# Altium project Tube03.PrjPCB
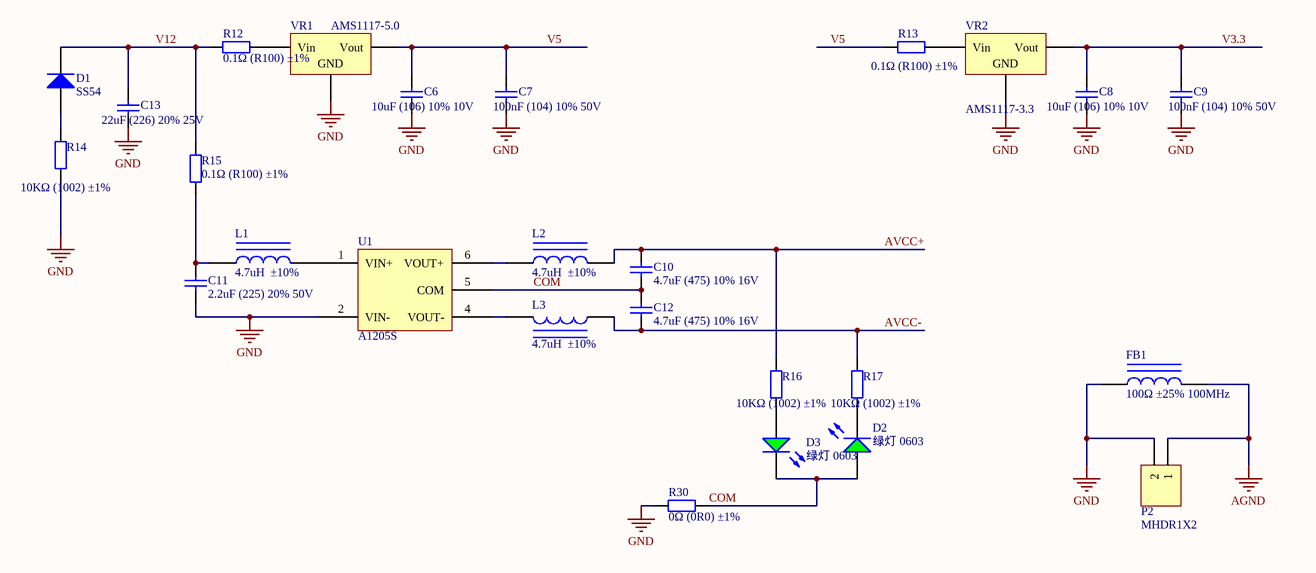
[diagram p0: Power.SchDoc]
6 sheets, 115 parts. Net scope: global (net labels, ports and power ports of the same name join across sheets).
Board file: Tube03.PcbDoc
Sheets:
  Power.SchDoc
  mcu1.SchDoc
  mcu2.SchDoc
  commu.SchDoc
  Amp.SchDoc
  Aex.SchDoc

## Sheet Power.SchDoc
size A4

### Parts
C6  10uF (106) 10% 10V  [0603_C]
C7  100nF (104) 10% 50V  [0603_C]
C8  10uF (106) 10% 10V  [0603_C]
C9  100nF (104) 10% 50V  [0603_C]
C10  4.7uF (475) 10% 16V  [0603_C]
C11  2.2uF (225) 20% 50V  [0805_C]
C12  4.7uF (475) 10% 16V  [0603_C]
C13  22uF (226) 20% 25V  [0805_C]
D1  SS54  [SMA(DO-214AC)_S1]
D2  绿灯 0603  [0603_LED_S1]
D3  绿灯 0603  [0603_LED_S1]
FB1  100Ω ±25% 100MHz  [0805_L]
L1  4.7uH  ±10%  [1206_L]
L2  4.7uH  ±10%  [1206_L]
L3  4.7uH  ±10%  [1206_L]
P2  MHDR1X2  [MHDR1X2]
R12  0.1Ω (R100) ±1%  [1206_R]
R13  0.1Ω (R100) ±1%  [1206_R]
R14  10KΩ (1002) ±1%  [0805_R]
R15  0.1Ω (R100) ±1%  [1206_R]
R16  10KΩ (1002) ±1%  [0603_R]
R17  10KΩ (1002) ±1%  [0603_R]
R30  0Ω (0R0) ±1%  [1206_R]
U1  A1205S  [A1205S]
VR1  AMS1117-5.0  [SOT-223]
VR2  AMS1117-3.3  [SOT-223]

### Nets
AGND: FB1.2 P2.1
GND: C6.1 C7.1 C8.1 C9.1 C11.1 C13.1 FB1.1 P2.2 R14.1 R30.1 U1.2(VIN-) VR1.1(GND) VR2.1(GND)
V3.3: C8.2 C9.2 VR2.2(Vout)
V5: C6.2 C7.2 R13.1 VR1.2(Vout)
AVCC+: C10.2 L2.2 R16.2
AVCC-: C12.1 L3.2 R17.2
COM: C10.1 C12.2 D2.A D3.K R30.2 U1.5(COM)
V12: C13.2 D1.2(K) R12.1 R15.2
NetC11_2: C11.2 L1.1 R15.1
NetD1_1: D1.1(A) R14.2
NetD2_K: D2.K R17.1
NetD3_A: D3.A R16.1
NetL1_2: L1.2 U1.1(VIN+)
NetL2_1: L2.1 U1.6(VOUT+)
NetL3_1: L3.1 U1.4(VOUT-)
NetR12_2: R12.2 VR1.3(Vin)
NetR13_2: R13.2 VR2.3(Vin)

### Library data of the parts
C6 C8 = 0603 10uF (106) 10% 10V: 贴片电容; ComponentLink1Description: 供应商链接; ComponentLink1URL: http://www.szlcsc.com/product/details_20411.html; Package: 0603; Supplier: LC; SuppliersPartNumber: C19702
C7 C9 = 0603 100nF (104) 10% 50V: 贴片电容; ComponentLink1Description: 供应商链接; ComponentLink1URL: http://www.szlcsc.com/product/details_15331.html; Package: 0603; Supplier: LC; SuppliersPartNumber: C14663
C10 C12 = 0603 4.7uF (475) 10% 16V: 贴片电容; ComponentLink1Description: 供应商链接; ComponentLink1URL: http://www.szlcsc.com/product/details_20375.html; Package: 0603; Supplier: LC; SuppliersPartNumber: C19666
C11 = 0805 2.2uF (225) 20% 50V: 贴片电容; ComponentLink1Description: 供应商链接; ComponentLink1URL: http://www.szlcsc.com/product/details_50225.html; Package: 0805; Supplier: LC; SuppliersPartNumber: C49217
C13 = 0805 22uF (226) 20% 25V: 贴片电容; ComponentLink1Description: 供应商链接; ComponentLink1URL: http://www.szlcsc.com/product/details_46786.html; Package: 0805; Supplier: LC; SuppliersPartNumber: C45783
D1 = SMA(DO-214AC) SS54: 二极管; ComponentLink1Description: 供应商链接; ComponentLink1URL: http://www.szlcsc.com/product/details_23178.html; Package: SMA(DO-214AC); Supplier: LC; SuppliersPartNumber: C22452
D2 D3 = 0603 绿灯: 发光二极管; ComponentLink1Description: 供应商链接; ComponentLink1URL: http://www.szlcsc.com/product/details_73152.html; Package: 0603; Supplier: LC; SuppliersPartNumber: C72043
FB1 = 0805 100Ω 25% 100MHz: 贴片磁珠; ComponentLink1Description: 供应商链接; ComponentLink1URL: http://www.szlcsc.com/product/details_1367.html; Package: 0805; Supplier: LC; SuppliersPartNumber: C1015
L1-L3 = 1206 4.7uH  10%: 贴片电感; ComponentLink1Description: 供应商链接; ComponentLink1URL: http://www.szlcsc.com/product/details_1401.html; Package: 1206; Supplier: LC; SuppliersPartNumber: C1049
P2 = MHDR1X2: Header, 2-Pin; LatestRevisionDate: 17-Jul-2002; LatestRevisionNote: Re-released for DXP Platform.; Publisher: Altium Limited
R12 R13 R15 = 1206 0.1Ω (R100) 1%: 贴片电阻; ComponentLink1Description: 供应商链接; ComponentLink1URL: http://www.szlcsc.com/product/details_26077.html; Package: 1206; Supplier: LC; SuppliersPartNumber: C25334
R14 = 0805 10KΩ (1002) 1%: 贴片电阻; ComponentLink1Description: 供应商链接; ComponentLink1URL: http://www.szlcsc.com/product/details_18102.html; Package: 0805; Supplier: LC; SuppliersPartNumber: C17414
R16 R17 = 0603 10KΩ (1002) 1%: 贴片电阻; ComponentLink1Description: 供应商链接; ComponentLink1URL: http://www.szlcsc.com/product/details_26547.html; Package: 0603; Supplier: LC; SuppliersPartNumber: C25804
R30 = 1206 0Ω (0R0) 1%: 贴片电阻; ComponentLink1Description: 供应商链接; ComponentLink1URL: http://www.szlcsc.com/product/details_18576.html; Package: 1206; Supplier: LC; SuppliersPartNumber: C17888
VR1 = SOT-223 AMS1117-5.0: 低压差线性稳压(LDO); ComponentLink1Description: 供应商链接; ComponentLink1URL: http://www.szlcsc.com/product/details_6653.html; Package: SOT-223; Supplier: LC; SuppliersPartNumber: C6187
VR2 = SOT-223 AMS1117-3.3: 低压差线性稳压(LDO); ComponentLink1Description: 供应商链接; ComponentLink1URL: http://www.szlcsc.com/product/details_6652.html; Package: SOT-223; Supplier: LC; SuppliersPartNumber: C6186

## Sheet mcu1.SchDoc
size A4
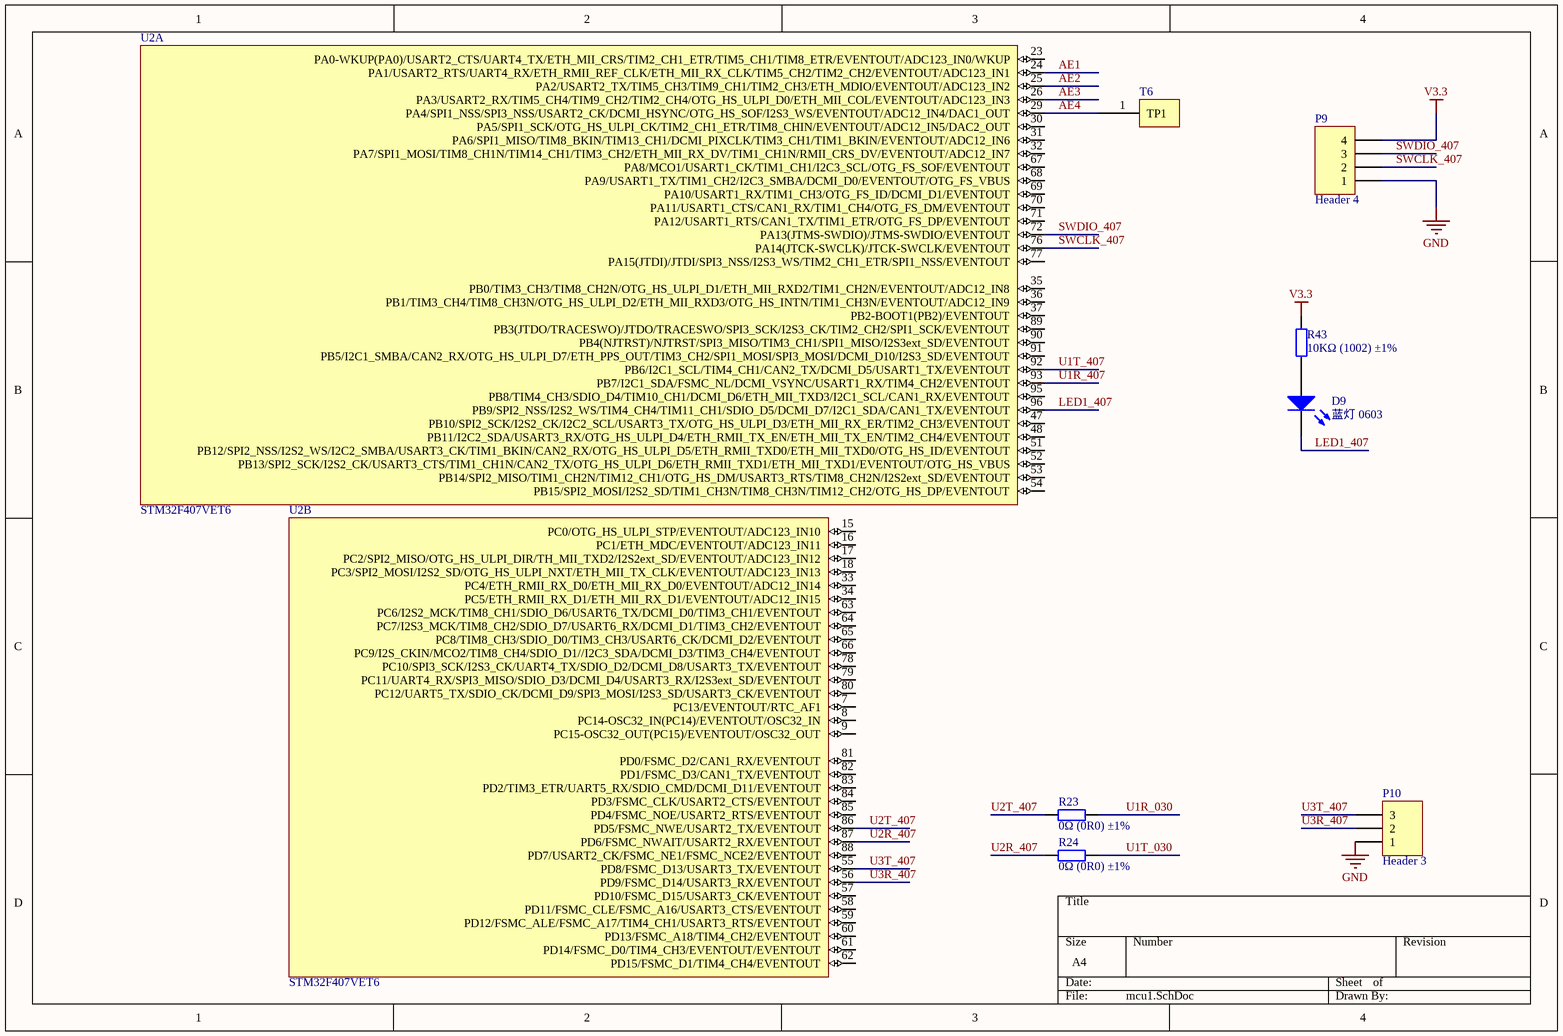
[diagram p1: mcu1.SchDoc]

### Parts
D9  蓝灯 0603  [0603_LED_S1]
P9  Header 4  [HDR1X4]
P10  Header 3  [HDR1X3]
R23  0Ω (0R0) ±1%  [0603_R]
R24  0Ω (0R0) ±1%  [0603_R]
R43  10KΩ (1002) ±1%  [0603_R]
T6  TP1  [TP1]  (value not drawn)
U2  STM32F407VET6  [LQFP-100_14x14x05P]  (parts A,B of 5)

### Nets
GND: P9.1 P10.1
V3.3: P9.4 R43.2
AE1: U2.24(PA1/USART2_RTS/UART4_RX/ETH_RMII_REF_CLK/ETH_MII_RX_CLK/TIM5_CH2/TIM2_CH2/EVENTOUT/ADC123_IN1)
AE2: U2.25(PA2/USART2_TX/TIM5_CH3/TIM9_CH1/TIM2_CH3/ETH_MDIO/EVENTOUT/ADC123_IN2)
AE3: U2.26(PA3/USART2_RX/TIM5_CH4/TIM9_CH2/TIM2_CH4/OTG_HS_ULPI_D0/ETH_MII_COL/EVENTOUT/ADC123_IN3)
AE4: T6.1(TP1) U2.29(PA4/SPI1_NSS/SPI3_NSS/USART2_CK/DCMI_HSYNC/OTG_HS_SOF/I2S3_WS/EVENTOUT/ADC12_IN4/DAC1_OUT)
LED1_407: D9.K U2.96(PB9/SPI2_NSS/I2S2_WS/TIM4_CH4/TIM11_CH1/SDIO_D5/DCMI_D7/I2C1_SDA/CAN1_TX/EVENTOUT)
SWCLK_407: P9.2 U2.76(PA14(JTCK-SWCLK)/JTCK-SWCLK/EVENTOUT)
SWDIO_407: P9.3 U2.72(PA13(JTMS-SWDIO)/JTMS-SWDIO/EVENTOUT)
U1R_030: R23.2
U1R_407: U2.93(PB7/I2C1_SDA/FSMC_NL/DCMI_VSYNC/USART1_RX/TIM4_CH2/EVENTOUT)
U1T_030: R24.2
U1T_407: U2.92(PB6/I2C1_SCL/TIM4_CH1/CAN2_TX/DCMI_D5/USART1_TX/EVENTOUT)
U2R_407: R24.1 U2.87(PD6/FSMC_NWAIT/USART2_RX/EVENTOUT)
U2T_407: R23.1 U2.86(PD5/FSMC_NWE/USART2_TX/EVENTOUT)
U3R_407: P10.2 U2.56(PD9/FSMC_D14/USART3_RX/EVENTOUT)
U3T_407: P10.3 U2.55(PD8/FSMC_D13/USART3_TX/EVENTOUT)
NetD9_A: D9.A R43.1

Not connected (* = marked no-connect by the designer): U2 7(PC13/EVENTOUT/RTC_AF1) 8(PC14-OSC32_IN(PC14)/EVENTOUT/OSC32_IN) 9(PC15-OSC32_OUT(PC15)/EVENTOUT/OSC32_OUT) 15(PC0/OTG_HS_ULPI_STP/EVENTOUT/ADC123_IN10) 16(PC1/ETH_MDC/EVENTOUT/ADC123_IN11) 17(PC2/SPI2_MISO/OTG_HS_ULPI_DIR/TH_MII_TXD2/I2S2ext_SD/EVENTOUT/ADC123_IN12) 18(PC3/SPI2_MOSI/I2S2_SD/OTG_HS_ULPI_NXT/ETH_MII_TX_CLK/EVENTOUT/ADC123_IN13) 23(PA0-WKUP(PA0)/USART2_CTS/UART4_TX/ETH_MII_CRS/TIM2_CH1_ETR/TIM5_CH1/TIM8_ETR/EVENTOUT/ADC123_IN0/WKUP) 30(PA5/SPI1_SCK/OTG_HS_ULPI_CK/TIM2_CH1_ETR/TIM8_CHIN/EVENTOUT/ADC12_IN5/DAC2_OUT) 31(PA6/SPI1_MISO/TIM8_BKIN/TIM13_CH1/DCMI_PIXCLK/TIM3_CH1/TIM1_BKIN/EVENTOUT/ADC12_IN6) 32(PA7/SPI1_MOSI/TIM8_CH1N/TIM14_CH1/TIM3_CH2/ETH_MII_RX_DV/TIM1_CH1N/RMII_CRS_DV/EVENTOUT/ADC12_IN7) 33(PC4/ETH_RMII_RX_D0/ETH_MII_RX_D0/EVENTOUT/ADC12_IN14) 34(PC5/ETH_RMII_RX_D1/ETH_MII_RX_D1/EVENTOUT/ADC12_IN15) 35(PB0/TIM3_CH3/TIM8_CH2N/OTG_HS_ULPI_D1/ETH_MII_RXD2/TIM1_CH2N/EVENTOUT/ADC12_IN8) 36(PB1/TIM3_CH4/TIM8_CH3N/OTG_HS_ULPI_D2/ETH_MII_RXD3/OTG_HS_INTN/TIM1_CH3N/EVENTOUT/ADC12_IN9) 37(PB2-BOOT1(PB2)/EVENTOUT) 47(PB10/SPI2_SCK/I2S2_CK/I2C2_SCL/USART3_TX/OTG_HS_ULPI_D3/ETH_MII_RX_ER/TIM2_CH3/EVENTOUT) 48(PB11/I2C2_SDA/USART3_RX/OTG_HS_ULPI_D4/ETH_RMII_TX_EN/ETH_MII_TX_EN/TIM2_CH4/EVENTOUT) 51(PB12/SPI2_NSS/I2S2_WS/I2C2_SMBA/USART3_CK/TIM1_BKIN/CAN2_RX/OTG_HS_ULPI_D5/ETH_RMII_TXD0/ETH_MII_TXD0/OTG_HS_ID/EVENTOUT) 52(PB13/SPI2_SCK/I2S2_CK/USART3_CTS/TIM1_CH1N/CAN2_TX/OTG_HS_ULPI_D6/ETH_RMII_TXD1/ETH_MII_TXD1/EVENTOUT/OTG_HS_VBUS) 53(PB14/SPI2_MISO/TIM1_CH2N/TIM12_CH1/OTG_HS_DM/USART3_RTS/TIM8_CH2N/I2S2ext_SD/EVENTOUT) 54(PB15/SPI2_MOSI/I2S2_SD/TIM1_CH3N/TIM8_CH3N/TIM12_CH2/OTG_HS_DP/EVENTOUT) 57(PD10/FSMC_D15/USART3_CK/EVENTOUT) 58(PD11/FSMC_CLE/FSMC_A16/USART3_CTS/EVENTOUT) 59(PD12/FSMC_ALE/FSMC_A17/TIM4_CH1/USART3_RTS/EVENTOUT) 60(PD13/FSMC_A18/TIM4_CH2/EVENTOUT) 61(PD14/FSMC_D0/TIM4_CH3/EVENTOUT/EVENTOUT) 62(PD15/FSMC_D1/TIM4_CH4/EVENTOUT) 63(PC6/I2S2_MCK/TIM8_CH1/SDIO_D6/USART6_TX/DCMI_D0/TIM3_CH1/EVENTOUT) 64(PC7/I2S3_MCK/TIM8_CH2/SDIO_D7/USART6_RX/DCMI_D1/TIM3_CH2/EVENTOUT) 65(PC8/TIM8_CH3/SDIO_D0/TIM3_CH3/USART6_CK/DCMI_D2/EVENTOUT) 66(PC9/I2S_CKIN/MCO2/TIM8_CH4/SDIO_D1//I2C3_SDA/DCMI_D3/TIM3_CH4/EVENTOUT) 67(PA8/MCO1/USART1_CK/TIM1_CH1/I2C3_SCL/OTG_FS_SOF/EVENTOUT) 68(PA9/USART1_TX/TIM1_CH2/I2C3_SMBA/DCMI_D0/EVENTOUT/OTG_FS_VBUS) 69(PA10/USART1_RX/TIM1_CH3/OTG_FS_ID/DCMI_D1/EVENTOUT) 70(PA11/USART1_CTS/CAN1_RX/TIM1_CH4/OTG_FS_DM/EVENTOUT) 71(PA12/USART1_RTS/CAN1_TX/TIM1_ETR/OTG_FS_DP/EVENTOUT) 77(PA15(JTDI)/JTDI/SPI3_NSS/I2S3_WS/TIM2_CH1_ETR/SPI1_NSS/EVENTOUT) 78(PC10/SPI3_SCK/I2S3_CK/UART4_TX/SDIO_D2/DCMI_D8/USART3_TX/EVENTOUT) 79(PC11/UART4_RX/SPI3_MISO/SDIO_D3/DCMI_D4/USART3_RX/I2S3ext_SD/EVENTOUT) 80(PC12/UART5_TX/SDIO_CK/DCMI_D9/SPI3_MOSI/I2S3_SD/USART3_CK/EVENTOUT) 81(PD0/FSMC_D2/CAN1_RX/EVENTOUT) 82(PD1/FSMC_D3/CAN1_TX/EVENTOUT) 83(PD2/TIM3_ETR/UART5_RX/SDIO_CMD/DCMI_D11/EVENTOUT) 84(PD3/FSMC_CLK/USART2_CTS/EVENTOUT) 85(PD4/FSMC_NOE/USART2_RTS/EVENTOUT) 88(PD7/USART2_CK/FSMC_NE1/FSMC_NCE2/EVENTOUT) 89(PB3(JTDO/TRACESWO)/JTDO/TRACESWO/SPI3_SCK/I2S3_CK/TIM2_CH2/SPI1_SCK/EVENTOUT) 90(PB4(NJTRST)/NJTRST/SPI3_MISO/TIM3_CH1/SPI1_MISO/I2S3ext_SD/EVENTOUT) 91(PB5/I2C1_SMBA/CAN2_RX/OTG_HS_ULPI_D7/ETH_PPS_OUT/TIM3_CH2/SPI1_MOSI/SPI3_MOSI/DCMI_D10/I2S3_SD/EVENTOUT) 95(PB8/TIM4_CH3/SDIO_D4/TIM10_CH1/DCMI_D6/ETH_MII_TXD3/I2C1_SCL/CAN1_RX/EVENTOUT)

### Library data of the parts
D9 = 0603 蓝灯: 发光二极管; ComponentLink1Description: 供应商链接; ComponentLink1URL: http://www.szlcsc.com/product/details_73150.html; Package: 0603; Supplier: LC; SuppliersPartNumber: C72041
P9 = Header 4: Header, 4-Pin; LatestRevisionDate: 17-Jul-2002; LatestRevisionNote: Re-released for DXP Platform.; Publisher: Altium Limited
P10 = Header 3: Header, 3-Pin; LatestRevisionDate: 17-Jul-2002; LatestRevisionNote: Re-released for DXP Platform.; Publisher: Altium Limited
R23 R24 = 0603 0Ω (0R0) 1%: 贴片电阻; ComponentLink1Description: 供应商链接; ComponentLink1URL: http://www.szlcsc.com/product/details_21903.html; Package: 0603; Supplier: LC; SuppliersPartNumber: C21189
R43 = 0603 10KΩ (1002) 1%: 贴片电阻; ComponentLink1Description: 供应商链接; ComponentLink1URL: http://www.szlcsc.com/product/details_26547.html; Package: 0603; Supplier: LC; SuppliersPartNumber: C25804
U2 = STM32F407VET6: ARM; ComponentLink1Description: 供应商链接; ComponentLink1URL: http://www.szlcsc.com/product/details_29482.html; Package: LQFP-100_14x14x05P; Supplier: LC; SuppliersPartNumber: C28730

## Sheet mcu2.SchDoc
size A4
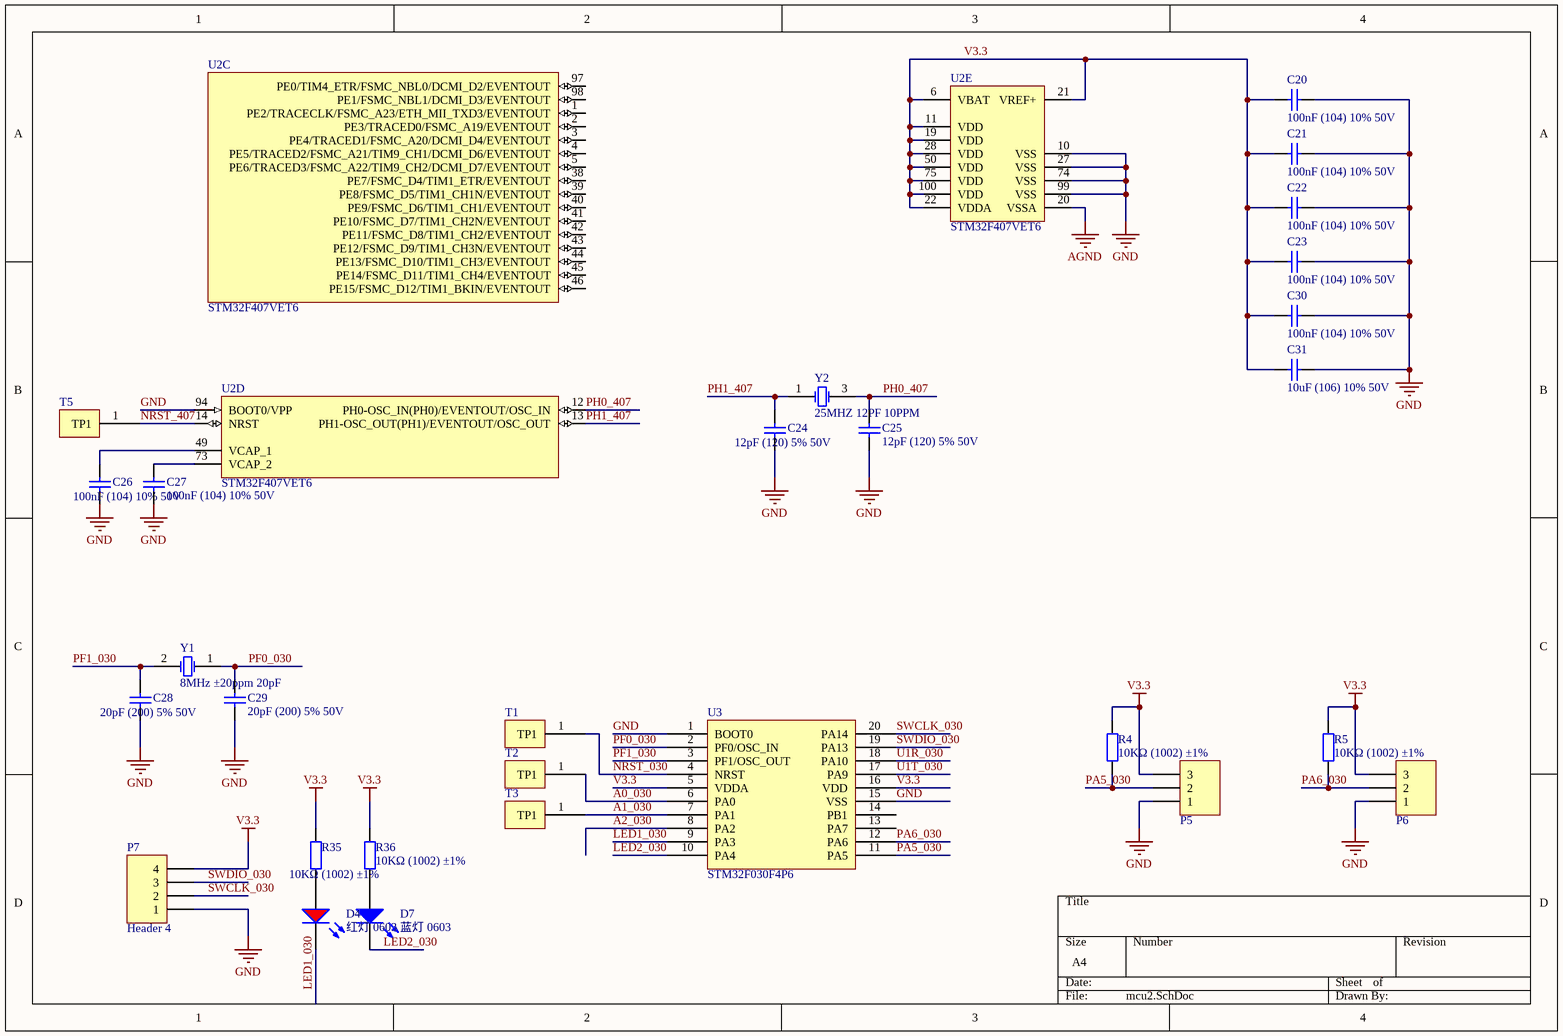
[diagram p2: mcu2.SchDoc]

### Parts
C20  100nF (104) 10% 50V  [0603_C]
C21  100nF (104) 10% 50V  [0603_C]
C22  100nF (104) 10% 50V  [0603_C]
C23  100nF (104) 10% 50V  [0603_C]
C24  12pF (120) 5% 50V  [0603_C]
C25  12pF (120) 5% 50V  [0603_C]
C26  100nF (104) 10% 50V  [0603_C]
C27  100nF (104) 10% 50V  [0603_C]
C28  20pF (200) 5% 50V  [0603_C]
C29  20pF (200) 5% 50V  [0603_C]
C30  100nF (104) 10% 50V  [1206_C]
C31  10uF (106) 10% 50V  [1206_C]
D4  红灯 0603  [0603_LED_S1]
D7  蓝灯 0603  [0603_LED_S1]
P5  Header 3  [HDR1X3]  (value not drawn)
P6  Header 3  [HDR1X3]  (value not drawn)
P7  Header 4  [HDR1X4]
R4  10KΩ (1002) ±1%  [0603_R]
R5  10KΩ (1002) ±1%  [0603_R]
R35  10KΩ (1002) ±1%  [0603_R]
R36  10KΩ (1002) ±1%  [0603_R]
T1  TP1  [TP1]  (value not drawn)
T2  TP1  [TP1]  (value not drawn)
T3  TP1  [TP1]  (value not drawn)
T5  TP1  [TP1]  (value not drawn)
U2  STM32F407VET6  [LQFP-100_14x14x05P]  (parts C,D,E of 5)
U3  STM32F030F4P6  [TSSOP-20]
Y1  8MHz ±20ppm 20pF  [SMD-5032_2P]
Y2  25MHZ 12PF 10PPM  [SMD-3225_4P]

### Nets
AGND: U2.20(VSSA)
GND: C20.2 C21.2 C22.2 C23.2 C24.1 C25.1 C26.1 C27.1 C28.1 C29.1 C30.2 C31.2 P5.1 P6.1 P7.1 U2.10(VSS) U2.27(VSS) U2.74(VSS) U2.94(BOOT0/VPP) U2.99(VSS) U3.1(BOOT0) U3.15(VSS)
V3.3: C20.1 C21.1 C22.1 C23.1 C30.1 C31.1 P5.3 P6.3 P7.4 R4.2 R5.2 R35.2 R36.2 U2.6(VBAT) U2.11(VDD) U2.19(VDD) U2.21(VREF+) U2.22(VDDA) U2.28(VDD) U2.50(VDD) U2.75(VDD) U2.100(VDD) U3.5(VDDA) U3.16(VDD)
A0_030: T2.1(TP1) U3.6(PA0)
A1_030: T3.1(TP1) U3.7(PA1)
A2_030: U3.8(PA2)
LED1_030: D4.K U3.9(PA3)
LED2_030: D7.K U3.10(PA4)
NRST_030: T1.1(TP1) U3.4(NRST)
NRST_407: T5.1(TP1) U2.14(NRST)
PA5_030: P5.2 R4.1 U3.11(PA5)
PA6_030: P6.2 R5.1 U3.12(PA6)
PF0_030: C29.2 U3.2(PF0/OSC_IN) Y1.1(OSC1)
PF1_030: C28.2 U3.3(PF1/OSC_OUT) Y1.2(OSC2)
PH0_407: C25.2 U2.12(PH0-OSC_IN(PH0)/EVENTOUT/OSC_IN) Y2.3(OSC2)
PH1_407: C24.2 U2.13(PH1-OSC_OUT(PH1)/EVENTOUT/OSC_OUT) Y2.1(OSC1)
SWCLK_030: P7.2 U3.20(PA14)
SWDIO_030: P7.3 U3.19(PA13)
U1R_030: U3.18(PA10)
U1T_030: U3.17(PA9)
NetC26_2: C26.2 U2.49(VCAP_1)
NetC27_2: C27.2 U2.73(VCAP_2)
NetD4_A: D4.A R35.1
NetD7_A: D7.A R36.1

Not connected (* = marked no-connect by the designer): U2 1(PE2/TRACECLK/FSMC_A23/ETH_MII_TXD3/EVENTOUT) 2(PE3/TRACED0/FSMC_A19/EVENTOUT) 3(PE4/TRACED1/FSMC_A20/DCMI_D4/EVENTOUT) 4(PE5/TRACED2/FSMC_A21/TIM9_CH1/DCMI_D6/EVENTOUT) 5(PE6/TRACED3/FSMC_A22/TIM9_CH2/DCMI_D7/EVENTOUT) 38(PE7/FSMC_D4/TIM1_ETR/EVENTOUT) 39(PE8/FSMC_D5/TIM1_CH1N/EVENTOUT) 40(PE9/FSMC_D6/TIM1_CH1/EVENTOUT) 41(PE10/FSMC_D7/TIM1_CH2N/EVENTOUT) 42(PE11/FSMC_D8/TIM1_CH2/EVENTOUT) 43(PE12/FSMC_D9/TIM1_CH3N/EVENTOUT) 44(PE13/FSMC_D10/TIM1_CH3/EVENTOUT) 45(PE14/FSMC_D11/TIM1_CH4/EVENTOUT) 46(PE15/FSMC_D12/TIM1_BKIN/EVENTOUT) 97(PE0/TIM4_ETR/FSMC_NBL0/DCMI_D2/EVENTOUT) 98(PE1/FSMC_NBL1/DCMI_D3/EVENTOUT); U3 13(PA7) 14(PB1)

### Library data of the parts
C20-C23 C26 C27 = 0603 100nF (104) 10% 50V: 贴片电容; ComponentLink1Description: 供应商链接; ComponentLink1URL: http://www.szlcsc.com/product/details_15331.html; Package: 0603; Supplier: LC; SuppliersPartNumber: C14663
C24 C25 = 0603 12pF (120) 5% 50V: 贴片电容; ComponentLink1Description: 供应商链接; ComponentLink1URL: http://www.szlcsc.com/product/details_39506.html; Package: 0603; Supplier: LC; SuppliersPartNumber: C38523
C28 C29 = 0603 20pF (200) 5% 50V: 贴片电容; ComponentLink1Description: 供应商链接; ComponentLink1URL: http://www.szlcsc.com/product/details_2000.html; Package: 0603; Supplier: LC; SuppliersPartNumber: C1648
C30 = 1206 100nF (104) 10% 50V: 贴片电容; ComponentLink1Description: 供应商链接; ComponentLink1URL: http://www.szlcsc.com/product/details_25237.html; Package: 1206; Supplier: LC; SuppliersPartNumber: C24497
C31 = 1206 10uF (106) 10% 50V: 贴片电容; ComponentLink1Description: 供应商链接; ComponentLink1URL: http://www.szlcsc.com/product/details_14236.html; Package: 1206; Supplier: LC; SuppliersPartNumber: C13585
D4 = 0603 红灯: 发光二极管; ComponentLink1Description: 供应商链接; ComponentLink1URL: http://www.szlcsc.com/product/details_2659.html; Package: 0603; Supplier: LC; SuppliersPartNumber: C2286
D7 = 0603 蓝灯: 发光二极管; ComponentLink1Description: 供应商链接; ComponentLink1URL: http://www.szlcsc.com/product/details_73150.html; Package: 0603; Supplier: LC; SuppliersPartNumber: C72041
P5 P6 = Header 3: Header, 3-Pin; LatestRevisionDate: 17-Jul-2002; LatestRevisionNote: Re-released for DXP Platform.; Publisher: Altium Limited
P7 = Header 4: Header, 4-Pin; LatestRevisionDate: 17-Jul-2002; LatestRevisionNote: Re-released for DXP Platform.; Publisher: Altium Limited
R4 R5 R35 R36 = 0603 10KΩ (1002) 1%: 贴片电阻; ComponentLink1Description: 供应商链接; ComponentLink1URL: http://www.szlcsc.com/product/details_26547.html; Package: 0603; Supplier: LC; SuppliersPartNumber: C25804
U2 = STM32F407VET6: ARM; ComponentLink1Description: 供应商链接; ComponentLink1URL: http://www.szlcsc.com/product/details_29482.html; Package: LQFP-100_14x14x05P; Supplier: LC; SuppliersPartNumber: C28730
U3 = STM32F030F4P6: ARM; ComponentLink1Description: 供应商链接; ComponentLink1URL: http://www.szlcsc.com/product/details_33873.html; Package: TSSOP-20; Supplier: LC; SuppliersPartNumber: C32908
Y1 = SMD-5032_2P 8MHz 20ppm 20pF: 贴片晶振; ComponentLink1Description: 供应商链接; ComponentLink1URL: http://www.szlcsc.com/product/details_117214.html; Package: SMD-5032_2P; Supplier: LC; SuppliersPartNumber: C115962
Y2 = SMD-3225_4P  25MHZ 12PF 10PPM: 贴片晶振; ComponentLink1Description: 供应商链接; ComponentLink1URL: http://www.szlcsc.com/product/details_9526.html; Package: SMD-3225_4P; Supplier: LC; SuppliersPartNumber: C9006

## Sheet commu.SchDoc
size A4
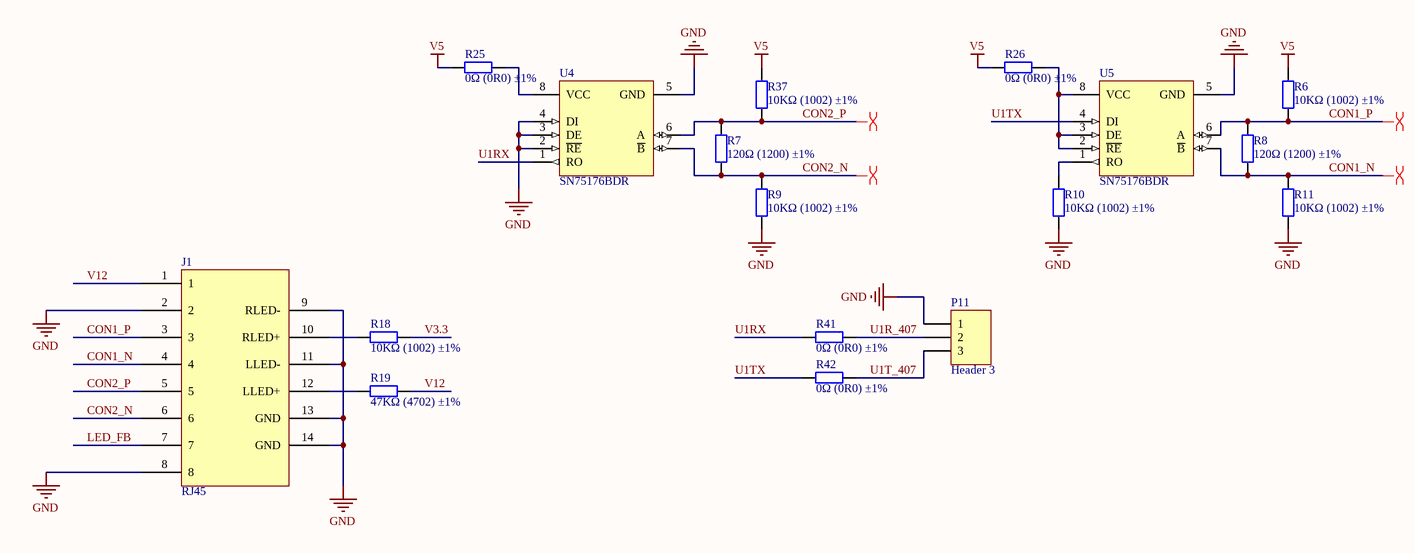
[diagram p3: commu.SchDoc]

### Parts
J1  RJ45  [RJ45_1]
P11  Header 3  [HDR1X3]
R6  10KΩ (1002) ±1%  [0603_R]
R7  120Ω (1200) ±1%  [0603_R]
R8  120Ω (1200) ±1%  [0603_R]
R9  10KΩ (1002) ±1%  [0603_R]
R10  10KΩ (1002) ±1%  [0603_R]
R11  10KΩ (1002) ±1%  [0603_R]
R18  10KΩ (1002) ±1%  [0603_R]
R19  47KΩ (4702) ±1%  [0603_R]
R25  0Ω (0R0) ±1%  [1206_R]
R26  0Ω (0R0) ±1%  [1206_R]
R37  10KΩ (1002) ±1%  [0603_R]
R41  0Ω (0R0) ±1%  [0603_R]
R42  0Ω (0R0) ±1%  [0603_R]
U4  SN75176BDR  [SOIC-8_150mil]
U5  SN75176BDR  [SOIC-8_150mil]

### Nets
GND: J1.2 J1.8 J1.9(RLED-) J1.11(LLED-) J1.13(GND) J1.14(GND) P11.1 R9.1 R10.1 R11.1 U4.2(~{RE}) U4.3(DE) U4.4(DI) U4.5(GND) U5.5(GND)
V3.3: R18.2
V5: R6.2 R25.1 R26.1 R37.2
CON1_N: J1.4 R8.1 R11.2 U5.7(~{B})
CON1_P: J1.3 R6.1 R8.2 U5.6(A)
CON2_N: J1.6 R7.1 R9.2 U4.7(~{B})
CON2_P: J1.5 R7.2 R37.1 U4.6(A)
LED_FB: J1.7
U1R_407: P11.2 R41.2
U1RX: R41.1 U4.1(RO)
U1T_407: P11.3 R42.2
U1TX: R42.1 U5.4(DI)
V12: J1.1 R19.2
NetJ1_10: J1.10(RLED+) R18.1
NetJ1_12: J1.12(LLED+) R19.1
NetR10_2: R10.2 U5.1(RO)
NetR25_2: R25.2 U4.8(VCC)
NetR26_2: R26.2 U5.2(~{RE}) U5.3(DE) U5.8(VCC)

### Layout directives
differential pair: CON1_N, CON1_P, CON2_N, CON2_P

### Library data of the parts
J1 = RJ45_1
P11 = Header 3: Header, 3-Pin; LatestRevisionDate: 17-Jul-2002; LatestRevisionNote: Re-released for DXP Platform.; Publisher: Altium Limited
R6 R9-R11 R18 R37 = 0603 10KΩ (1002) 1%: 贴片电阻; ComponentLink1Description: 供应商链接; ComponentLink1URL: http://www.szlcsc.com/product/details_26547.html; Package: 0603; Supplier: LC; SuppliersPartNumber: C25804
R7 R8 = 0603 120Ω (1200) 1%: 贴片电阻; ComponentLink1Description: 供应商链接; ComponentLink1URL: http://www.szlcsc.com/product/details_23514.html; Package: 0603; Supplier: LC; SuppliersPartNumber: C22787
R19 = 0603 47KΩ (4702) 1%: 贴片电阻; ComponentLink1Description: 供应商链接; ComponentLink1URL: http://www.szlcsc.com/product/details_26562.html; Package: 0603; Supplier: LC; SuppliersPartNumber: C25819
R25 R26 = 1206 0Ω (0R0) 1%: 贴片电阻; ComponentLink1Description: 供应商链接; ComponentLink1URL: http://www.szlcsc.com/product/details_18576.html; Package: 1206; Supplier: LC; SuppliersPartNumber: C17888
R41 R42 = 0603 0Ω (0R0) 1%: 贴片电阻; ComponentLink1Description: 供应商链接; ComponentLink1URL: http://www.szlcsc.com/product/details_21903.html; Package: 0603; Supplier: LC; SuppliersPartNumber: C21189
U4 U5 = SN75176BDR_[C7063]: RS-485/RS-422; ComponentLink1Description: 供应商链接; ComponentLink1URL: http://www.szlcsc.com/product/details_7535.html; Package: SOIC-8_150mil; Supplier: LC; SuppliersPartNumber: C7063

## Sheet Amp.SchDoc
size A4
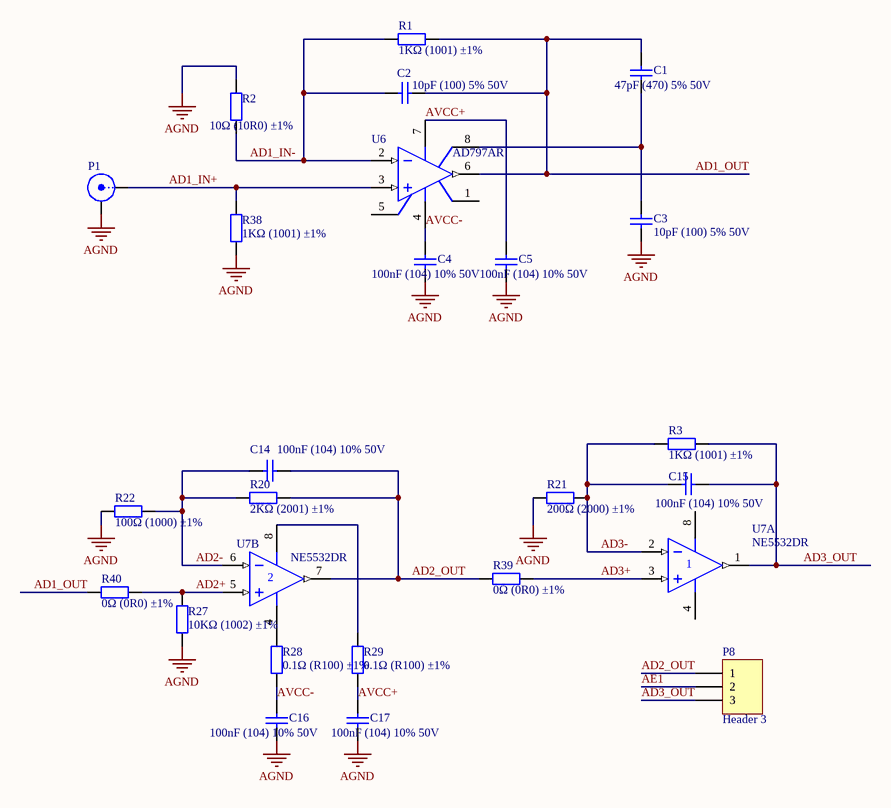
[diagram p4: Amp.SchDoc]

### Parts
C1  47pF (470) 5% 50V  [0603_C]
C2  10pF (100) 5% 50V  [0603_C]
C3  10pF (100) 5% 50V  [0603_C]
C4  100nF (104) 10% 50V  [0603_C]
C5  100nF (104) 10% 50V  [0603_C]
C14  100nF (104) 10% 50V  [0603_C]
C15  100nF (104) 10% 50V  [0603_C]
C16  100nF (104) 10% 50V  [0603_C]
C17  100nF (104) 10% 50V  [0603_C]
P1  SMB  [SMB_V-RJ45]  (value not drawn)
P8  Header 3  [HDR1X3]
R1  1KΩ (1001) ±1%  [0603_R]
R2  10Ω (10R0) ±1%  [0603_R]
R3  1KΩ (1001) ±1%  [0603_R]
R20  2KΩ (2001) ±1%  [0603_R]
R21  200Ω (2000) ±1%  [0603_R]
R22  100Ω (1000) ±1%  [0603_R]
R27  10KΩ (1002) ±1%  [0603_R]
R28  0.1Ω (R100) ±1%  [1206_R]
R29  0.1Ω (R100) ±1%  [1206_R]
R38  1KΩ (1001) ±1%  [0603_R]
R39  0Ω (0R0) ±1%  [0603_R]
R40  0Ω (0R0) ±1%  [0603_R]
U6  AD797AR  [SO-8C_N]
U7  NE5532DR  [SOIC-8_150mil]  (parts A,B of 2)

### Nets
AGND: C3.1 C4.1 C5.1 C16.1 C17.1 P1.2(Y) R2.2 R21.1 R22.1 R27.1 R38.1
AD1_IN+: P1.1(X) R38.2 U6.3(IN+)
AD1_IN-: C2.2 R1.2 R2.1 U6.2(IN-)
AD1_OUT: C1.2 C2.1 R1.1 R40.1 U6.6(OUT)
AD2+: R27.2 R40.2 U7.5(IN+)
AD2-: C14.1 R20.1 R22.2 U7.6(IN-)
AD2_OUT: C14.2 P8.1 R20.2 R39.1 U7.7(OUT)
AD3+: R39.2 U7.3(IN+)
AD3-: C15.1 R3.1 R21.2 U7.2(IN-)
AD3_OUT: C15.2 P8.3 R3.2 U7.1(OUT)
AE1: P8.2
AVCC+: C5.2 C17.2 R29.1 U6.7(V+)
AVCC-: C4.2 C16.2 R28.1 U6.4(V-)
NetC1_1: C1.1 C3.2 U6.8(DECMPEN)
NetR28_2: R28.2 U7.4(V-)
NetR29_2: R29.2 U7.8(V+)

Not connected (* = marked no-connect by the designer): U6 1(OS_NUL) 5(OS_NUL)

### Library data of the parts
C1 = 0603 47pF (470) 5% 50V: 贴片电容; ComponentLink1Description: 供应商链接; ComponentLink1URL: http://www.szlcsc.com/product/details_2023.html; Package: 0603; Supplier: LC; SuppliersPartNumber: C1671
C2 C3 = 0603 10pF (100) 5% 50V: 贴片电容; ComponentLink1Description: 供应商链接; ComponentLink1URL: http://www.szlcsc.com/product/details_1986.html; Package: 0603; Supplier: LC; SuppliersPartNumber: C1634
C4 C5 C14-C17 = 0603 100nF (104) 10% 50V: 贴片电容; ComponentLink1Description: 供应商链接; ComponentLink1URL: http://www.szlcsc.com/product/details_15331.html; Package: 0603; Supplier: LC; SuppliersPartNumber: C14663
P1 = SMB: SMB Straight Connector; LatestRevisionDate: 17-Jul-2002; LatestRevisionNote: Re-released for DXP Platform.; Publisher: Altium Limited
P8 = Header 3: Header, 3-Pin; LatestRevisionDate: 17-Jul-2002; LatestRevisionNote: Re-released for DXP Platform.; Publisher: Altium Limited
R1 R3 R38 = 0603 1KΩ (1001) 1%: 贴片电阻; ComponentLink1Description: 供应商链接; ComponentLink1URL: http://www.szlcsc.com/product/details_21904.html; Package: 0603; Supplier: LC; SuppliersPartNumber: C21190
R2 = 0603 10Ω (10R0) 1%: 贴片电阻; ComponentLink1Description: 供应商链接; ComponentLink1URL: http://www.szlcsc.com/product/details_23586.html; Package: 0603; Supplier: LC; SuppliersPartNumber: C22859
R20 = 0603 2KΩ (2001) 1%: 贴片电阻; ComponentLink1Description: 供应商链接; ComponentLink1URL: http://www.szlcsc.com/product/details_23702.html; Package: 0603; Supplier: LC; SuppliersPartNumber: C22975
R21 = 0603 200Ω (2000) 1%: 贴片电阻; ComponentLink1Description: 供应商链接; ComponentLink1URL: http://www.szlcsc.com/product/details_8708.html; Package: 0603; Supplier: LC; SuppliersPartNumber: C8218
R22 = 0603 100Ω (1000) 1%: 贴片电阻; ComponentLink1Description: 供应商链接; ComponentLink1URL: http://www.szlcsc.com/product/details_23502.html; Package: 0603; Supplier: LC; SuppliersPartNumber: C22775
R27 = 0603 10KΩ (1002) 1%: 贴片电阻; ComponentLink1Description: 供应商链接; ComponentLink1URL: http://www.szlcsc.com/product/details_26547.html; Package: 0603; Supplier: LC; SuppliersPartNumber: C25804
R28 R29 = 1206 0.1Ω (R100) 1%: 贴片电阻; ComponentLink1Description: 供应商链接; ComponentLink1URL: http://www.szlcsc.com/product/details_26077.html; Package: 1206; Supplier: LC; SuppliersPartNumber: C25334
R39 R40 = 0603 0Ω (0R0) 1%: 贴片电阻; ComponentLink1Description: 供应商链接; ComponentLink1URL: http://www.szlcsc.com/product/details_21903.html; Package: 0603; Supplier: LC; SuppliersPartNumber: C21189
U6 = AD797AR: Ultra-Low Distortion, Ultra-Low Noise Operational Amplifier; Published: 8-Jun-2000; LatestRevisionDate: 13-Apr-2006; LatestRevisionNote: IPC-7351 Footprint Added.; DatasheetVersion: REV. C; PackageVersion: revC; PackageReference: SO-8C; Publisher: Altium Limited; PackageDescription: 8-Pin Small Outline Integrated Circuit 1.27 mm Pitch; Code_IPC: SOIC127P600-8; ComponentLink1Description: Manufacturer Link; ComponentLink1URL: http://www.analog.com/en/prod/0,,759_786_AD797%2C00.html; ComponentLink2Description: Datasheet; ComponentLink2URL: http://www.analog.com/UploadedFiles/Data_Sheets/507345751AD797_d.pdf
U7 = NE5532DR_[C7426]: 功放; ComponentLink1Description: 供应商链接; ComponentLink1URL: http://www.szlcsc.com/product/details_7903.html; Package: SOIC-8_150mil; Supplier: LC; SuppliersPartNumber: C7426

## Sheet Aex.SchDoc
size A4
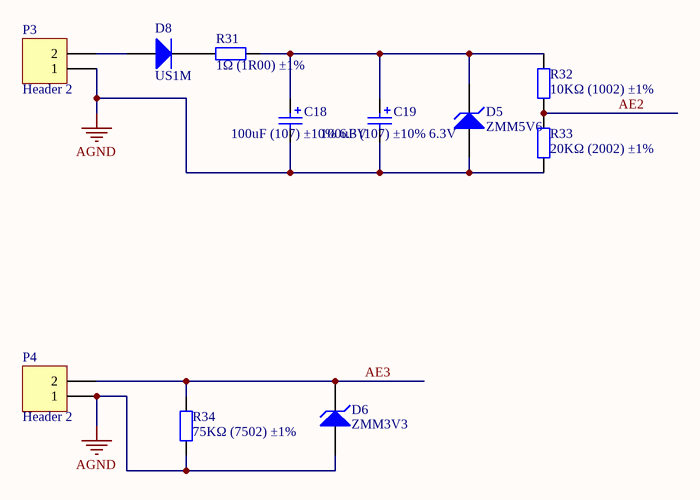
[diagram p5: Aex.SchDoc]

### Parts
C18  100uF (107) ±10% 6.3V  [CASE-B_3528]
C19  100uF (107) ±10% 6.3V  [CASE-B_3528]
D5  ZMM5V6  [LL-34]
D6  ZMM3V3  [LL-34]
D8  US1M  [SMA(DO-214AC)_S1]
P3  Header 2  [HDR1X2]
P4  Header 2  [HDR1X2]
R31  1Ω (1R00) ±1%  [0603_R]
R32  10KΩ (1002) ±1%  [0603_R]
R33  20KΩ (2002) ±1%  [0603_R]
R34  75KΩ (7502) ±1%  [0603_R]

### Nets
AGND: C18.2 C19.2 D5.1(A) D6.1(A) P3.1 P4.1 R33.1 R34.1
AE2: R32.1 R33.2
AE3: D6.2(K) P4.2 R34.2
NetC18_1: C18.1 C19.1 D5.2(K) R31.2 R32.2
NetD8_1: D8.1(A) P3.2
NetD8_2: D8.2(K) R31.1

### Library data of the parts
C18 C19 = 3528 100uF (107) 10% 6.3V: 钽电容; ComponentLink1Description: 供应商链接; ComponentLink1URL: http://www.szlcsc.com/product/details_16815.html; Package: 3528; Supplier: LC; SuppliersPartNumber: C16133
D5 = LL-34 ZMM5V6: 稳压二极管; ComponentLink1Description: 供应商链接; ComponentLink1URL: http://www.szlcsc.com/product/details_8541.html; Package: LL-34; Supplier: LC; SuppliersPartNumber: C8062
D6 = LL-34 ZMM3V3: 稳压二极管; ComponentLink1Description: 供应商链接; ComponentLink1URL: http://www.szlcsc.com/product/details_8535.html; Package: LL-34; Supplier: LC; SuppliersPartNumber: C8056
D8 = SMA(DO-214AC) US1M: 二极管; ComponentLink1Description: 供应商链接; ComponentLink1URL: http://www.szlcsc.com/product/details_5885.html; Package: SMA(DO-214AC); Supplier: LC; SuppliersPartNumber: C5441
P3 P4 = Header 2: Header, 2-Pin; LatestRevisionDate: 17-Jul-2002; LatestRevisionNote: Re-released for DXP Platform.; Publisher: Altium Limited
R31 = 0603 1Ω (1R00) 1%: 贴片电阻; ComponentLink1Description: 供应商链接; ComponentLink1URL: http://www.szlcsc.com/product/details_23663.html; Package: 0603; Supplier: LC; SuppliersPartNumber: C22936
R32 = 0603 10KΩ (1002) 1%: 贴片电阻; ComponentLink1Description: 供应商链接; ComponentLink1URL: http://www.szlcsc.com/product/details_26547.html; Package: 0603; Supplier: LC; SuppliersPartNumber: C25804
R33 = 0603 20KΩ (2002) 1%: 贴片电阻; ComponentLink1Description: 供应商链接; ComponentLink1URL: http://www.szlcsc.com/product/details_4591.html; Package: 0603; Supplier: LC; SuppliersPartNumber: C4184
R34 = 0603 75KΩ (7502) 1%: 贴片电阻; ComponentLink1Description: 供应商链接; ComponentLink1URL: http://www.szlcsc.com/product/details_23969.html; Package: 0603; Supplier: LC; SuppliersPartNumber: C23242

## Nets that join several sheets
AGND: Power (FB1.2 P2.1), mcu2 (U2.20), Amp (11 pins), Aex (8 pins)
GND: Power (13 pins), mcu1 (P9.1 P10.1), mcu2 (22 pins), commu (15 pins)
V3.3: Power (C8.2 C9.2 VR2.2), mcu1 (P9.4 R43.2), mcu2 (24 pins), commu (R18.2)
V5: Power (C6.2 C7.2 R13.1 VR1.2), commu (R6.2 R25.1 R26.1 R37.2)
AE1: mcu1 (U2.24), Amp (P8.2)
AE2: mcu1 (U2.25), Aex (R32.1 R33.2)
AE3: mcu1 (U2.26), Aex (D6.2 P4.2 R34.2)
AVCC+: Power (C10.2 L2.2 R16.2), Amp (C5.2 C17.2 R29.1 U6.7)
AVCC-: Power (C12.1 L3.2 R17.2), Amp (C4.2 C16.2 R28.1 U6.4)
U1R_030: mcu1 (R23.2), mcu2 (U3.18)
U1R_407: mcu1 (U2.93), commu (P11.2 R41.2)
U1T_030: mcu1 (R24.2), mcu2 (U3.17)
U1T_407: mcu1 (U2.92), commu (P11.3 R42.2)
V12: Power (C13.2 D1.2 R12.1 R15.2), commu (J1.1 R19.2)